# EAGLE design MB_STM32_VL (EAGLE 6.4)
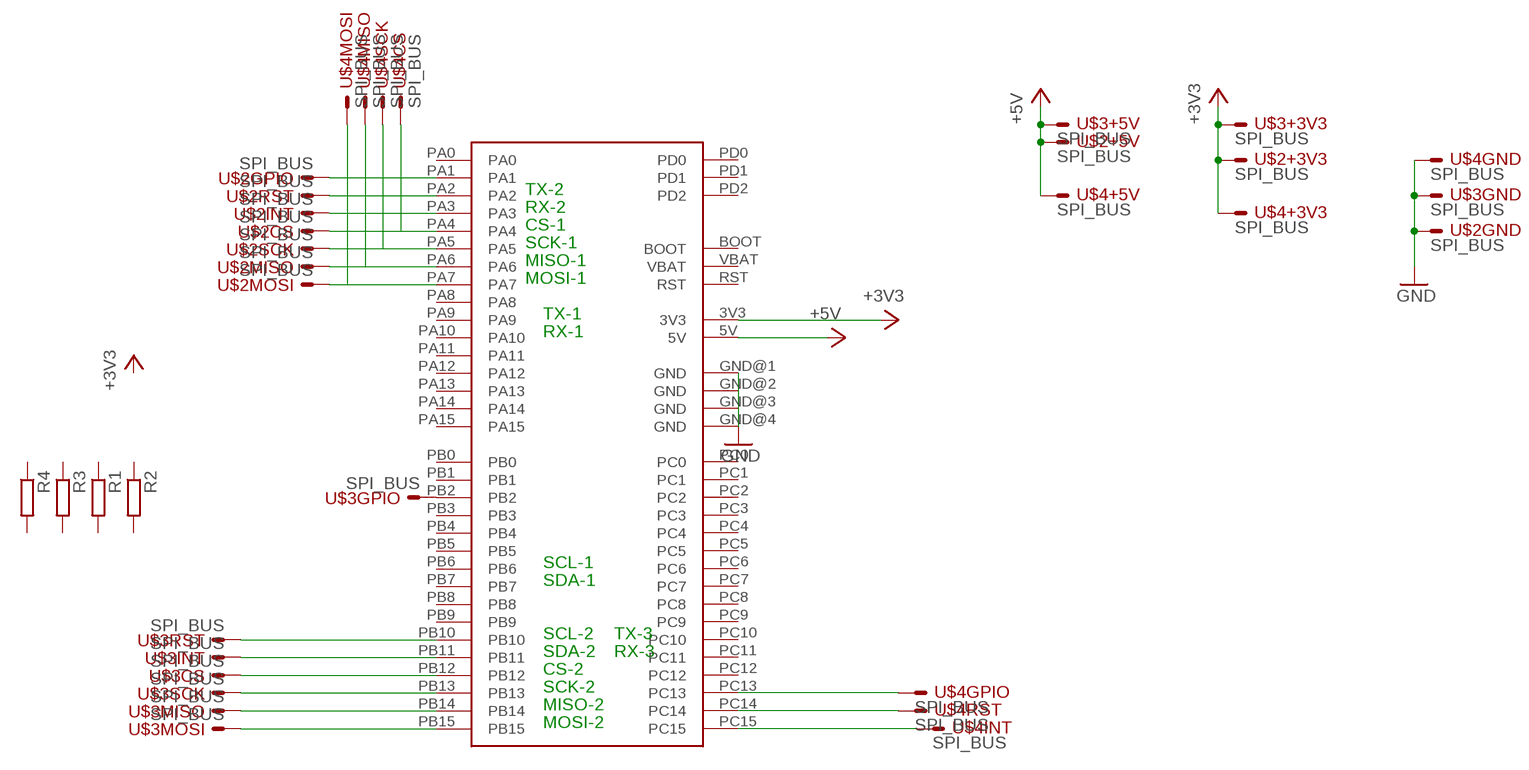
[diagram p0: schematic, sheet 1]

## Parts
R1  R-EU_0204/7  [0204/7]
R2  R-EU_0204/7  [0204/7]
R3  R-EU_0204/7  [0204/7]
R4  R-EU_0204/7  [0204/7]
U$1  STM32_DISCOVERY  [STM32_DISCOVERY]
U$2  SPI_BUS  [SPI_BUS]
U$3  SPI_BUS  [SPI_BUS]
U$4  SPI_BUS  [SPI_BUS]

## Nets
+3V3: U$1.3V3 U$2.+3V3 U$3.+3V3 U$4.+3V3
+5V: U$1.5V U$2.+5V U$3.+5V U$4.+5V
GND: U$1.GND@1(GND) U$1.GND@2(GND) U$1.GND@3(GND) U$1.GND@4(GND) U$2.GND U$3.GND U$4.GND
N$1: U$1.PA7 U$2.MOSI U$4.MOSI
N$2: U$1.PA6 U$2.MISO U$4.MISO
N$3: U$1.PA5 U$2.SCK U$4.SCK
N$4: U$1.PA4 U$2.CS U$4.CS
N$5: U$1.PB15 U$3.MOSI
N$6: U$1.PB14 U$3.MISO
N$7: U$1.PB13 U$3.SCK
N$8: U$1.PB12 U$3.CS
N$9: U$1.PB11 U$3.INT
N$10: U$1.PB10 U$3.RST
N$11: U$1.PB2 U$3.GPIO
N$12: U$1.PA3 U$2.INT
N$13: U$1.PA2 U$2.RST
N$14: U$1.PA1 U$2.GPIO
N$15: U$1.PC13 U$4.GPIO
N$16: U$1.PC14 U$4.RST
N$17: U$1.PC15 U$4.INT
Unconnected: R1.1 R1.2 R2.1 R2.2 R3.1 R3.2 R4.1 R4.2 U$1.BOOT U$1.NC@1(NC) U$1.NC@2(NC) U$1.PA0 U$1.PA8 U$1.PA9 U$1.PA10 U$1.PA11 U$1.PA12 U$1.PA13 U$1.PA14 U$1.PA15 U$1.PB0 U$1.PB1 U$1.PB3 U$1.PB4 U$1.PB5 U$1.PB6 U$1.PB7 U$1.PB8 U$1.PB9 U$1.PC0 U$1.PC1 U$1.PC2 U$1.PC3 U$1.PC4 U$1.PC5 U$1.PC6 U$1.PC7 U$1.PC8 U$1.PC9 U$1.PC10 U$1.PC11 U$1.PC12 U$1.PD0 U$1.PD1 U$1.PD2 U$1.RST U$1.VBAT

## Notes on the sheet
- TX-2
- RX-2
- CS-1
- SCK-1
- MISO-1
- MOSI-1
- TX-1
- RX-1
- SCL-1
- SDA-1
- SCL-2 | TX-3
- SDA-2 | RX-3
- CS-2
- SCK-2
- MISO-2
- MOSI-2

## Library data of the parts
R1-R4 = resistor:R-EU_: RESISTOR, European symbol
U$1 = stm32_discovery:STM32_DISCOVERY: STM32 Value line discovery
U$2-U$4 = lieven:SPI_BUS

## Board
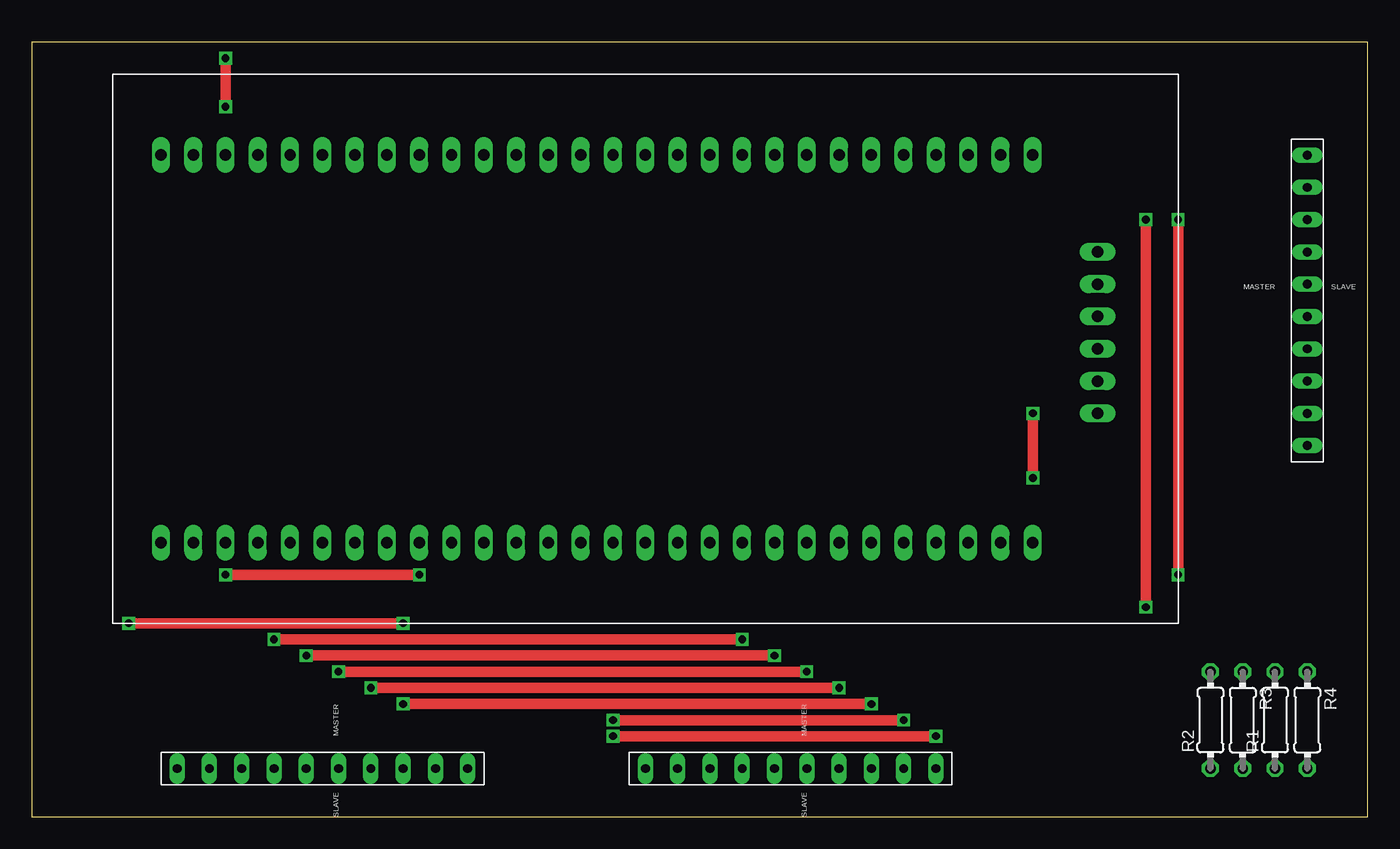
[diagram p1: board, top side]
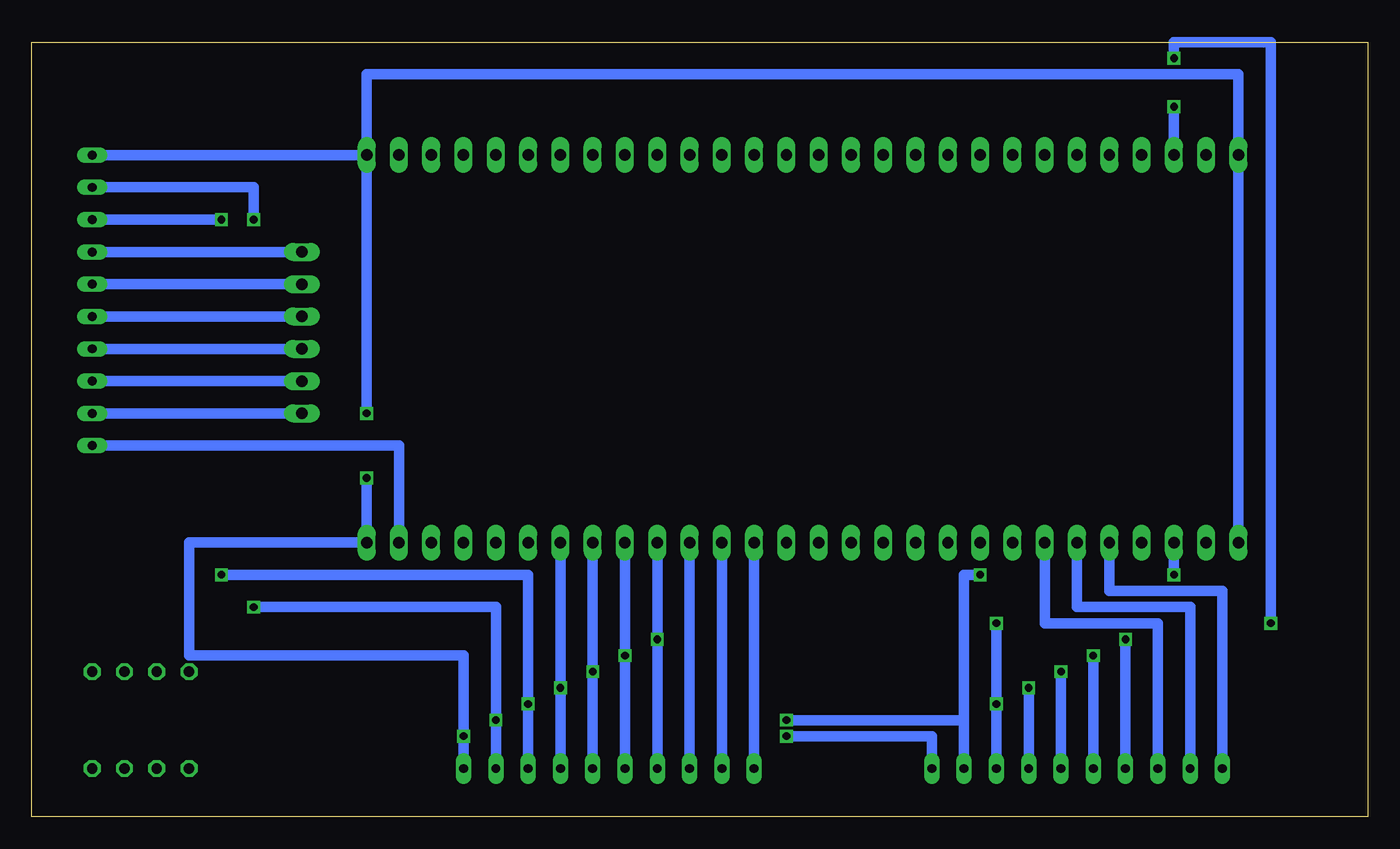
[diagram p2: board, bottom side, seen from below]

Size 105.08 x 60.95 mm. Coordinates in mm from the lower left corner, seen from the top.
Outline: 0,0 105.08,0 105.08,60.95 0,60.95 0,0
Copper layers (1*16): Top 0.035mm / dielectric 1.5mm / Bottom 0.035mm
Design rules "default": minimum track width 10mil, minimum drill 24mil, track to track 8mil, track to pad 8mil, pad to pad 8mil, via to via 8mil, smd to smd 8mil, copper to edge 40mil, drill to drill 8mil, minimum pad ring 10mil, minimum via ring 8mil, stop-mask expansion 4mil, vias tented up to drill 0mil, thermal gap 10mil

### Footprints (pad centres in the part's own frame; a part is rotated, then mirrored left to right if it is on the bottom)
0204/7 = drill 0.813 octagon: 1 -3.81,0; 2 3.81,0
STM32_DISCOVERY = drill 0.9 long: 3V3 -15.24,29.21; 5V 15.24,29.21; BOOT 15.24,21.59; GND@1 -15.24,34.29; GND@2 15.24,34.29; GND@3 -15.24,-34.29; GND@4 15.24,-34.29; NC@1 -15.24,31.75; NC@2 15.24,31.75; PA0 -15.24,-1.27; PA1 -15.24,-3.81; PA2 -15.24,-6.35; PA3 -15.24,-8.89; PA4 -15.24,-11.43; PA5 -15.24,-13.97; PA6 -15.24,-16.51; PA7 -15.24,-19.05; PA8 15.24,-21.59; PA9 15.24,-19.05; PA10 15.24,-16.51; PA11 15.24,-13.97; PA12 15.24,-11.43; PA13 15.24,-8.89; PA14 15.24,-6.35; PA15 15.24,-3.81; PB0 -15.24,-26.67; PB1 -15.24,-29.21; PB2 -15.24,-31.75; PB3 15.24,8.89; PB4 15.24,11.43; PB5 15.24,13.97; PB6 15.24,16.51; PB7 15.24,19.05; PB8 15.24,24.13; PB9 15.24,26.67; PB10 -5.08,-39.37; PB11 -2.54,-39.37; PB12 0,-39.37; PB13 2.54,-39.37; PB14 5.08,-39.37; PB15 7.62,-39.37; PC0 -15.24,8.89; PC1 -15.24,6.35; PC2 -15.24,3.81; PC3 -15.24,1.27; PC4 -15.24,-21.59; PC5 -15.24,-24.13; PC6 15.24,-31.75; PC7 15.24,-29.21; PC8 15.24,-26.67; PC9 15.24,-24.13; PC10 15.24,-1.27; PC11 15.24,1.27; PC12 15.24,3.81; PC13 -15.24,24.13; PC14 -15.24,21.59; PC15 -15.24,19.05; PD0 -15.24,16.51; PD1 -15.24,13.97; PD2 15.24,6.35; RST -15.24,11.43; VBAT -15.24,26.67
SPI_BUS = drill 0.7 long: +3V3 0,2.54; +5V 0,5.08; CS 0,15.24; GND 0,0; GPIO 0,22.86; INT 0,17.78; MISO 0,10.16; MOSI 0,7.62; RST 0,20.32; SCK 0,12.7

### Placement (x,y rotation side)
R1  97.79,7.62 90 top
R2  92.71,7.62 90 top
R3  95.25,7.62 270 top
R4  100.33,7.62 270 top
U$1  44.45,36.83 90 top
U$2  71.12,3.81 90 top
U$3  100.33,52.07 180 top
U$4  34.29,3.81 90 top

### Tracks (layer width: path | path; a pad name or v marks a point on that pad's centre or on a via)
+3V3  (via drill 0.6)
  Top 0.813: v87.63,46.99 v87.63,16.51 | v45.72,7.62 v68.58,7.62 | v15.24,19.05 v30.48,19.05
  Bottom 0.813: U$3.+3V3 87.63,49.53 v87.63,46.99 | v87.63,16.51 68.58,16.51 v68.58,7.62 U$2.+3V3 | U$4.+3V3 31.75,7.62 | U$1.3V3 v15.24,19.05 | v30.48,19.05 31.75,19.05 31.75,7.62 | 31.75,7.62 v45.72,7.62
+5V  (via drill 0.6)
  Top 0.813: v90.17,46.99 v90.17,19.05 | v29.21,8.89 v66.04,8.89 | v29.21,15.24 v7.62,15.24 | v15.24,59.69 v15.24,55.88
  Bottom 0.813: U$3.+5V v90.17,46.99 | v90.17,19.05 66.04,19.05 v66.04,8.89 U$2.+5V | U$4.+5V v29.21,8.89 v29.21,15.24 | v7.62,15.24 7.62,60.96 15.24,60.96 v15.24,59.69 | v15.24,55.88 U$1.5V
GND  (via drill 0.6)
  Top 0.813: v78.74,31.75 v78.74,26.67 | v45.72,6.35 v71.12,6.35
  Bottom 0.813: U$1.GND@1 U$1.GND@2 10.16,58.42 78.74,58.42 U$1.GND@4 | U$3.GND U$1.GND@4 | U$1.GND@4 v78.74,31.75 | v78.74,26.67 U$1.GND@3 92.71,21.59 92.71,12.7 71.12,12.7 v71.12,6.35 U$2.GND | U$4.GND 34.29,6.35 v45.72,6.35
N$1  (via drill 0.6)
  Top 0.813: v26.67,10.16 v63.5,10.16
  Bottom 0.813: U$1.PA7 v63.5,10.16 U$2.MOSI | U$4.MOSI v26.67,10.16
N$2  (via drill 0.6)
  Top 0.813: v24.13,11.43 v60.96,11.43
  Bottom 0.813: U$2.MISO v60.96,11.43 U$1.PA6 | U$4.MISO v24.13,11.43
N$3  (via drill 0.6)
  Top 0.813: v21.59,12.7 v58.42,12.7
  Bottom 0.813: U$4.SCK v21.59,12.7 | U$2.SCK v58.42,12.7 U$1.PA5
N$4  (via drill 0.6)
  Top 0.813: v19.05,13.97 v55.88,13.97
  Bottom 0.813: U$4.CS v19.05,13.97 | U$1.PA4 v55.88,13.97 U$2.CS
N$5
  Bottom 0.813: U$1.PB15 U$3.MOSI
N$6
  Bottom 0.813: U$3.MISO U$1.PB14
N$7
  Bottom 0.813: U$1.PB13 U$3.SCK
N$8
  Bottom 0.813: U$3.CS U$1.PB12
N$9
  Bottom 0.813: U$1.PB11 U$3.INT
N$10
  Bottom 0.813: U$3.RST U$1.PB10
N$11
  Bottom 0.813: U$3.GPIO 76.2,29.21 U$1.PB2
N$12
  Bottom 0.813: U$2.INT U$1.PA3
N$13
  Bottom 0.813: U$2.RST U$1.PA2
N$14
  Bottom 0.813: U$1.PA1 U$2.GPIO
N$15
  Bottom 0.813: U$4.GPIO 11.43,17.78 20.32,17.78 U$1.PC13
N$16
  Bottom 0.813: U$1.PC14 22.86,16.51 13.97,16.51 U$4.RST
N$17
  Bottom 0.813: U$1.PC15 25.4,15.24 16.51,15.24 U$4.INT